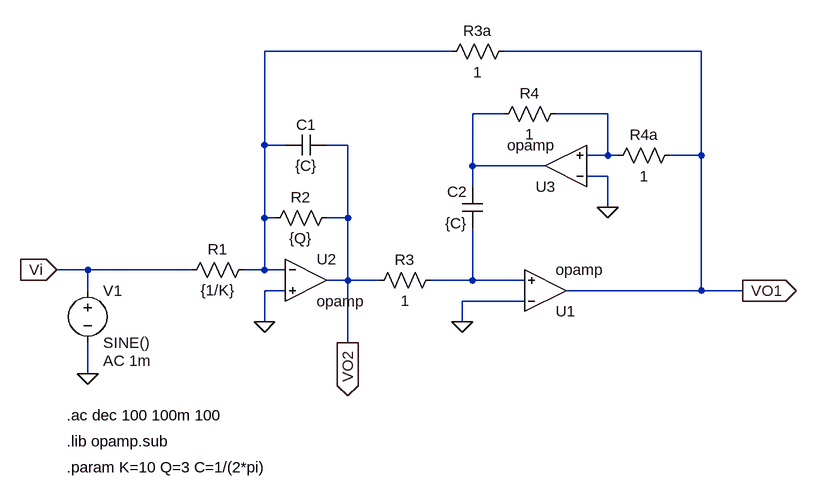
[diagram p0: schematic TS2.asc]
TS2.asc, the LTspice schematic file:
Version 4
SHEET 1 880 680
WIRE 48 -224 -240 -224
WIRE 432 -224 128 -224
WIRE 128 -128 80 -128
WIRE 288 -128 208 -128
WIRE -240 -80 -240 -224
WIRE -208 -80 -240 -80
WIRE -112 -80 -144 -80
WIRE 288 -64 288 -128
WIRE 288 -64 256 -64
WIRE 304 -64 288 -64
WIRE 432 -64 432 -224
WIRE 432 -64 384 -64
WIRE 80 -48 80 -128
WIRE 192 -48 80 -48
WIRE 288 -32 256 -32
WIRE 80 -16 80 -48
WIRE 288 16 288 -32
WIRE -240 32 -240 -80
WIRE -224 32 -240 32
WIRE -112 32 -112 -80
WIRE -112 32 -144 32
WIRE -512 112 -560 112
WIRE -352 112 -512 112
WIRE -240 112 -240 32
WIRE -240 112 -272 112
WIRE -208 112 -240 112
WIRE -112 128 -112 32
WIRE -112 128 -144 128
WIRE -64 128 -112 128
WIRE 80 128 80 48
WIRE 80 128 16 128
WIRE 160 128 80 128
WIRE -512 144 -512 112
WIRE -208 144 -240 144
WIRE 432 144 432 -64
WIRE 432 144 224 144
WIRE 496 144 432 144
WIRE 160 160 64 160
WIRE -240 192 -240 144
WIRE 64 192 64 160
WIRE -112 224 -112 128
WIRE -512 272 -512 224
FLAG 64 192 0
FLAG -240 192 0
FLAG 288 16 0
FLAG -512 272 0
FLAG 496 144 VO1
IOPIN 496 144 Out
FLAG -112 224 VO2
IOPIN -112 224 Out
FLAG -560 112 Vi
IOPIN -560 112 In
SYMBOL OpAmps\\opamp 192 208 M180
SYMATTR InstName U1
SYMBOL OpAmps\\opamp -176 64 R0
SYMATTR InstName U2
SYMBOL OpAmps\\opamp 224 16 R180
SYMATTR InstName U3
SYMBOL res -256 96 R90
WINDOW 0 0 56 VBottom 2
WINDOW 3 32 56 VTop 2
SYMATTR InstName R1
SYMATTR Value {1/K}
SYMBOL res -128 16 R90
WINDOW 0 0 56 VBottom 2
WINDOW 3 32 56 VTop 2
SYMATTR InstName R2
SYMATTR Value {Q}
SYMBOL res 32 112 R90
WINDOW 0 0 56 VBottom 2
WINDOW 3 32 56 VTop 2
SYMATTR InstName R3
SYMATTR Value 1
SYMBOL res 400 -80 R90
WINDOW 0 0 56 VBottom 2
WINDOW 3 32 56 VTop 2
SYMATTR InstName R4a
SYMATTR Value 1
SYMBOL res 224 -144 R90
WINDOW 0 0 56 VBottom 2
WINDOW 3 32 56 VTop 2
SYMATTR InstName R4
SYMATTR Value 1
SYMBOL res 144 -240 R90
WINDOW 0 0 56 VBottom 2
WINDOW 3 32 56 VTop 2
SYMATTR InstName R3a
SYMATTR Value 1
SYMBOL cap 96 48 R180
WINDOW 0 24 56 Left 2
WINDOW 3 24 8 Left 2
SYMATTR InstName C2
SYMATTR Value {C}
SYMBOL cap -144 -96 R90
WINDOW 0 0 32 VBottom 2
WINDOW 3 32 32 VTop 2
SYMATTR InstName C1
SYMATTR Value {C}
SYMBOL voltage -512 128 R0
WINDOW 123 24 124 Left 2
WINDOW 39 0 0 Left 0
SYMATTR Value2 AC 1m
SYMATTR InstName V1
SYMATTR Value SINE()
TEXT -544 376 Left 2 !.lib opamp.sub
TEXT -544 336 Left 2 !.ac dec 100 100m 100
TEXT -544 416 Left 2 !.param K=10 Q=3 C=1/(2*pi)

The netlist it stands for:
* TS2.asc
XU1 0 N004 VO1 opamp Aol=100K GBW=10Meg  ; pins invin noninvin out
XU2 N001 0 VO2 opamp Aol=100K GBW=10Meg  ; pins invin noninvin out
XU3 0 N003 N002 opamp Aol=100K GBW=10Meg  ; pins invin noninvin out
R1 N001 Vi {1/K}
R2 VO2 N001 {Q}
R3 N004 VO2 1
R4a VO1 N003 1
R4 N003 N002 1
R3a VO1 N001 1
C2 N004 N002 {C}
C1 VO2 N001 {C}
V1 Vi 0 SINE() AC 1m
.lib opamp.sub
.ac dec 100 100m 100
.param K=10 Q=3 C=1/(2*pi)
.backanno
.end